# Altium schematic sheet controls.SchDoc
size 297 x 209 mm
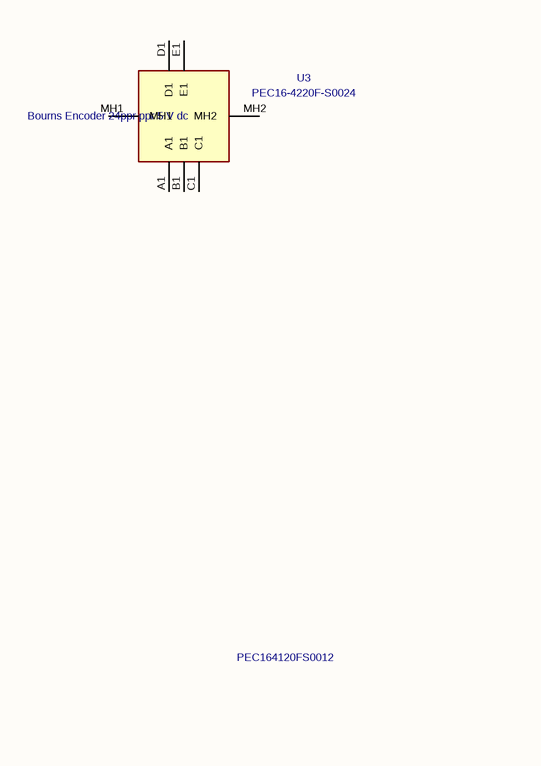
[diagram p0: controls.SchDoc, top]
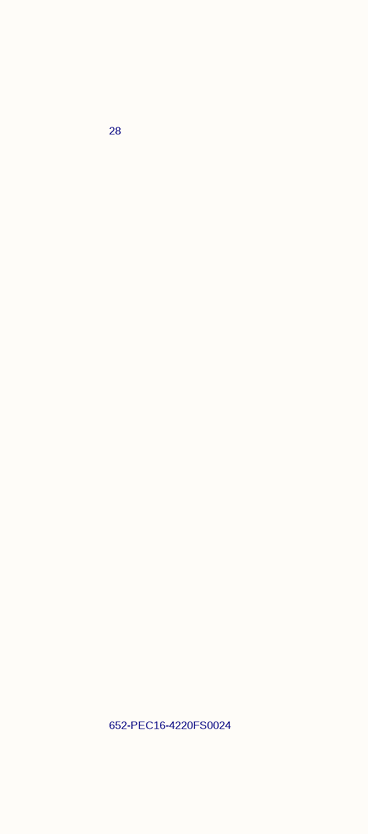
[diagram p1: controls.SchDoc, centre]
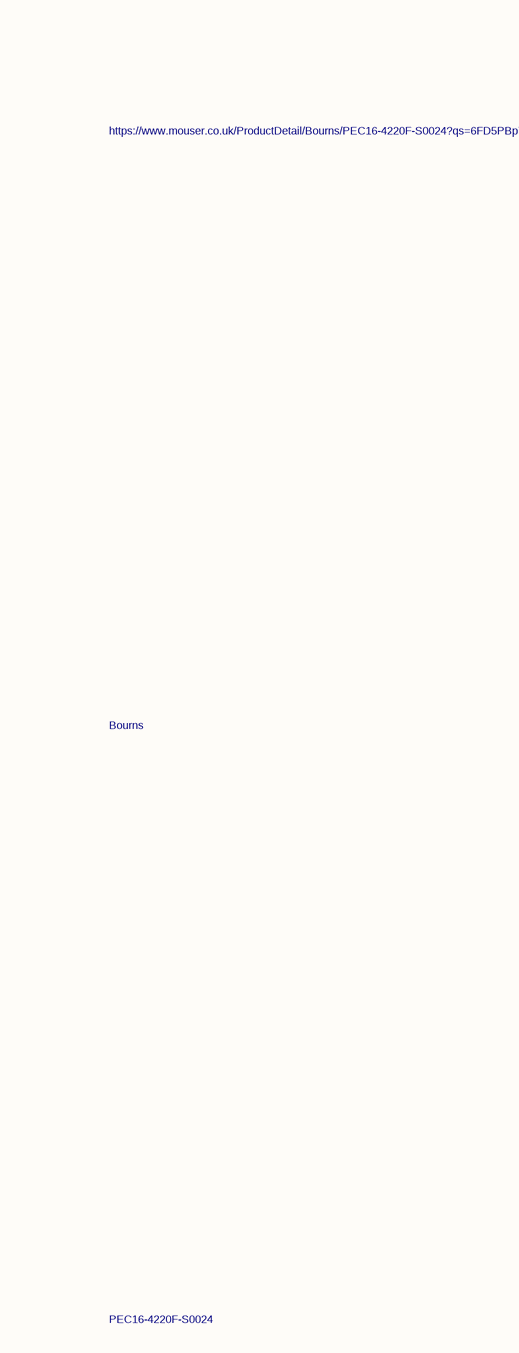
[diagram p2: controls.SchDoc, bottom]

## Parts
U3  Description: Bourns Encoder 24ppr ppr 5 V dc  Height: 28  Mouser Part Number: 652-PEC16-4220FS0024  Manufacturer_Name: Bourns  [PEC164120FS0012]  (hidden comment: PEC16-4220F-S0024)

## Nets

Not connected (* = marked no-connect by the designer): U3 A1 B1 C1 D1 E1 MH1 MH2

## Notes on the sheet
- 1
- 2
- 3
- 4
- 5
- 6
- A
- B
- C
- D
- Title:
- File: controls.kicad_sch
- Sheet: /
- KiCad E.D.A.  kicad (5.1.4)-1
- Size: A4
- Date:
- Rev:
- Id: 1/1

## Library data of the parts
U3 = PEC16-4220F-S0024: Mouser Price/Stock: https://www.mouser.co.uk/ProductDetail/Bourns/PEC16-4220F-S0024?qs=6FD5PBp7ZtQte%252Bg7b%2FiMUw%3D%3D; Manufacturer_Part_Number: PEC16-4220F-S0024; Value: PEC16-4220F-S0024